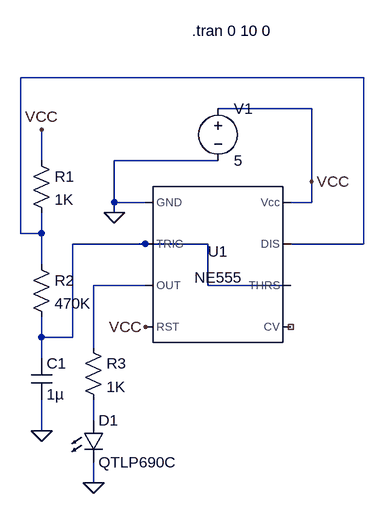
[diagram p0: schematic ltspice_sim.asc]
ltspice_sim.asc, the LTspice schematic file:
Version 4
SHEET 1 880 688
WIRE 672 32 144 32
WIRE 592 80 448 80
WIRE 176 160 176 112
WIRE 448 160 288 160
WIRE 592 192 592 80
WIRE 288 224 288 160
WIRE 336 224 288 224
WIRE 592 224 592 192
WIRE 592 224 560 224
WIRE 288 240 288 224
WIRE 144 272 144 32
WIRE 176 272 176 240
WIRE 176 272 144 272
WIRE 336 288 224 288
WIRE 432 288 336 288
WIRE 672 288 672 32
WIRE 672 288 560 288
WIRE 176 320 176 272
WIRE 336 352 256 352
WIRE 432 352 432 288
WIRE 560 352 432 352
WIRE 176 432 176 400
WIRE 224 432 224 288
WIRE 224 432 176 432
WIRE 256 448 256 352
WIRE 176 464 176 432
WIRE 256 560 256 528
WIRE 176 576 176 528
WIRE 256 656 256 624
FLAG 288 240 0
FLAG 176 112 VCC
FLAG 176 576 0
FLAG 256 656 0
FLAG 336 416 VCC
FLAG 592 192 VCC
SYMBOL NE555 448 320 R0
SYMATTR InstName U1
SYMBOL res 160 144 R0
SYMATTR InstName R1
SYMATTR Value 1K
SYMBOL res 160 304 R0
SYMATTR InstName R2
SYMATTR Value 470K
SYMBOL res 240 432 R0
SYMATTR InstName R3
SYMATTR Value 1K
SYMBOL cap 160 464 R0
SYMATTR InstName C1
SYMATTR Value 1µ
SYMBOL LED 240 560 R0
SYMATTR InstName D1
SYMATTR Value QTLP690C
SYMBOL voltage 448 64 R0
SYMATTR InstName V1
SYMATTR Value 5
TEXT 408 -40 Left 2 !.tran 0 10 0

The netlist it stands for:
* ltspice_sim.asc
XU1 0 N002 N003 VCC NC_01 N002 N001 VCC NE555  ; pins GND TRIG OUT RST CV THRS DIS Vcc
R1 VCC N001 1K
R2 N001 N002 470K
R3 N003 N004 1K
C1 N002 0 1µ
D1 N004 0 QTLP690C
V1 VCC 0 5
.model D D
.lib standard.dio
.tran 0 10 0
.lib NE555.sub
.backanno
.end